# Altium schematic sheet GbEthernet.SchDoc: SoM Gb Ethernet
size Letter; Engineer: Nathan Petersen; DocumentNumber: 20; Revision: v1.2; SheetNumber: 20; SheetTotal: 23
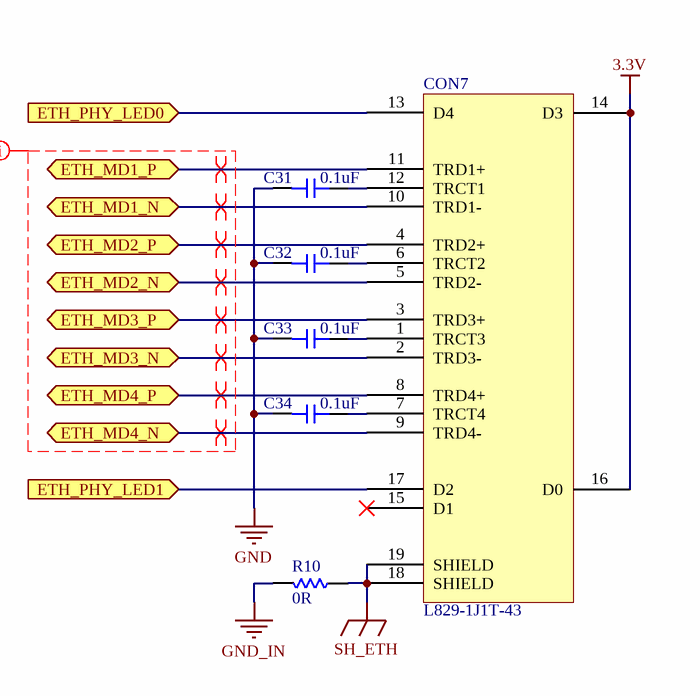
[diagram p0: GbEthernet.SchDoc]

## Parts
C31  value 0.1uF  [0603-CAP]  (hidden comment: Capacitor)
C32  value 0.1uF  [0603-CAP]  (hidden comment: Capacitor)
C33  value 0.1uF  [0603-CAP]  (hidden comment: Capacitor)
C34  value 0.1uF  [0603-CAP]  (hidden comment: Capacitor)
CON7  L829-1J1T-43  [L829-1J1T-43]
R10  value 0R  [1206-RES]  (hidden comment: Resistor)

## Ports
ETH_MD1_N (bidir), ETH_MD1_P (bidir), ETH_MD2_N (bidir), ETH_MD2_P (bidir), ETH_MD3_N (bidir), ETH_MD3_P (bidir), ETH_MD4_N (bidir), ETH_MD4_P (bidir), ETH_PHY_LED0 (in), ETH_PHY_LED1 (in)

## Nets
3.3V: CON7.14(D3) CON7.16(D0)
GND: C31.1 C32.1 C33.1 C34.1
GND_IN: R10.2
SH_ETH: CON7.18(SHIELD) CON7.19(SHIELD) R10.1
ETH_MD1_N: CON7.10(TRD1-) ; port ETH_MD1_N
ETH_MD1_P: CON7.11(TRD1+) ; port ETH_MD1_P
ETH_MD2_N: CON7.5(TRD2-) ; port ETH_MD2_N
ETH_MD2_P: CON7.4(TRD2+) ; port ETH_MD2_P
ETH_MD3_N: CON7.2(TRD3-) ; port ETH_MD3_N
ETH_MD3_P: CON7.3(TRD3+) ; port ETH_MD3_P
ETH_MD4_N: CON7.9(TRD4-) ; port ETH_MD4_N
ETH_MD4_P: CON7.8(TRD4+) ; port ETH_MD4_P
ETH_PHY_LED0: CON7.13(D4) ; port ETH_PHY_LED0
ETH_PHY_LED1: CON7.17(D2) ; port ETH_PHY_LED1
NetC31_2: C31.2 CON7.12(TRCT1)
NetC32_2: C32.2 CON7.6(TRCT2)
NetC33_2: C33.2 CON7.1(TRCT3)
NetC34_2: C34.2 CON7.7(TRCT4)

Not connected (* = marked no-connect by the designer): CON7 15(D1)*

## Layout directives
differential pair: ETH_MD1_N, ETH_MD1_P, ETH_MD2_N, ETH_MD2_P, ETH_MD3_N, ETH_MD3_P, ETH_MD4_N, ETH_MD4_P
net class Ethernet: (no net found under the mark)

## Notes on the sheet
- Title:
- File:
- Sheet:
- of
- Revision:
- Time:
- Date:
- Engineer:

## Library data of the parts
C31-C34 = Capacitor: Supplier 1: Digi-Key; Supplier Part Number 1: 1276-1012-6-ND
CON7 = L829-1J1T-43: Supplier 1: Digi-Key; Supplier Part Number 1: 380-1110-ND
R10 = Resistor: Supplier 1: Digi-Key; Supplier Part Number 1: 311-0.0ERCT-ND